# Altium schematic sheet LM_HTR_001.SchDoc: Land Meter Heater Assembly
size Tabloid; DocumentNumber: LM_HTR_001; Revision: A; SheetNumber: 1; SheetTotal: 1
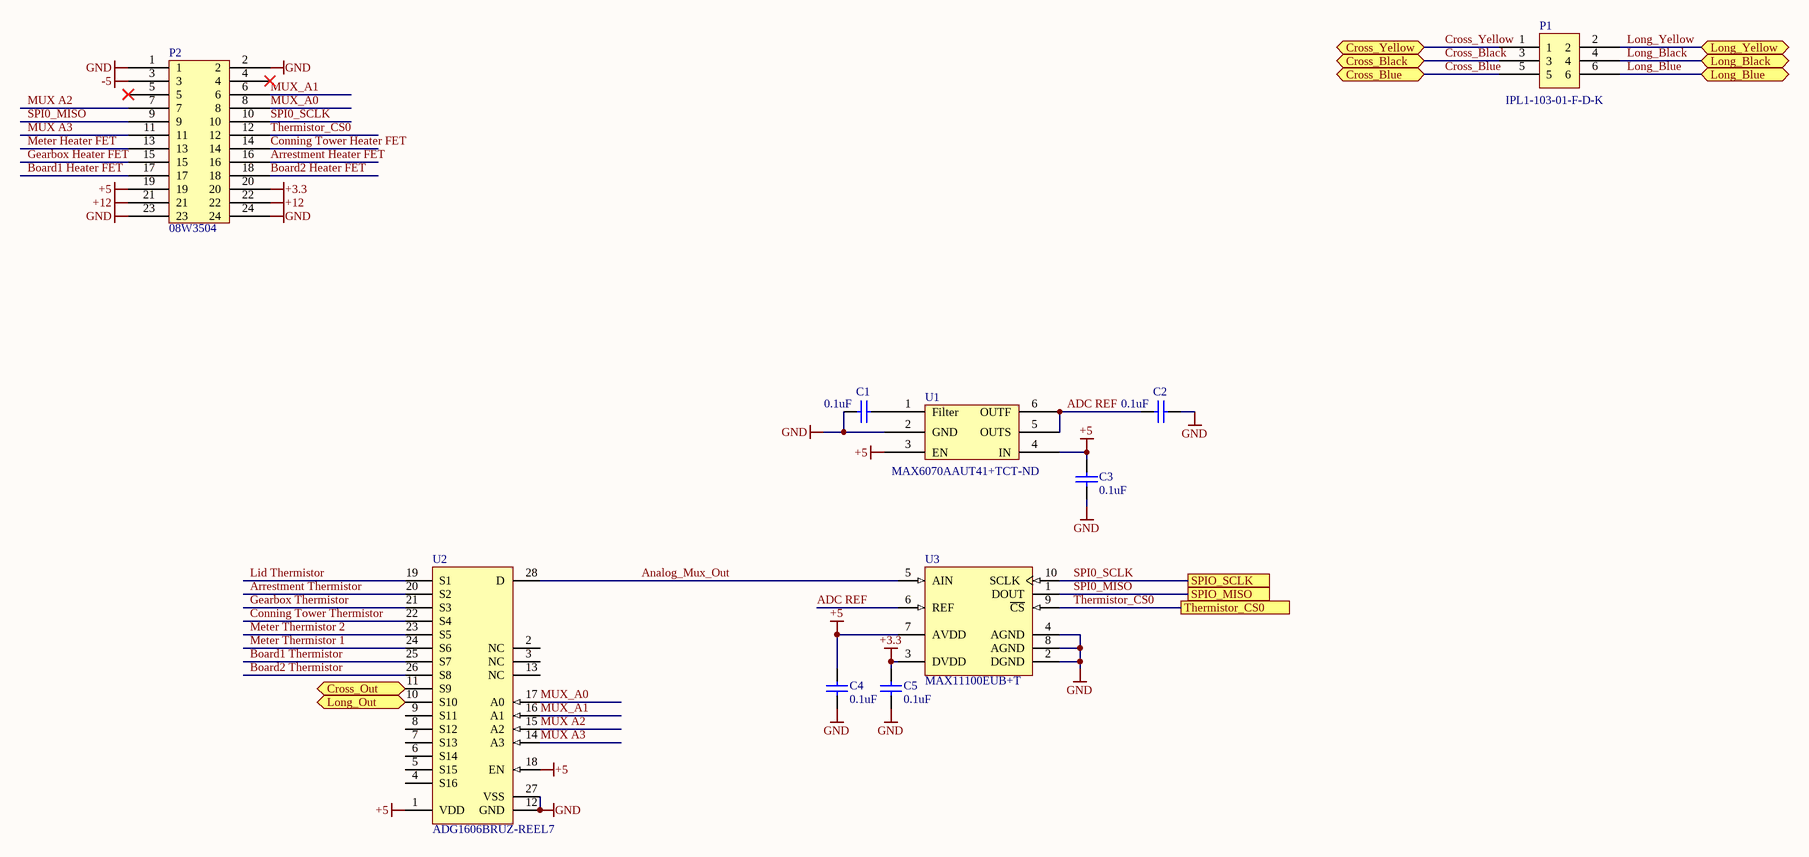
[diagram p0: LM_HTR_001.SchDoc]

## Parts
C1  0.1uF  [CAPC0402(1005)60_L]
C2  0.1uF  [CAPC0402(1005)60_L]
C3  0.1uF  [CAPC0402(1005)60_L]
C4  0.1uF  [CAPC0402(1005)60_L]
C5  0.1uF  [CAPC0402(1005)60_L]
P1  Manufacturer Part Number: IPL1-103-01-F-D-K  [IPL1-103-01-F-D]  (hidden comment: IPL1-103-01-F-D)
P2  Supplier Part Number 1: 08W3504  [IPL1-112-01-F-S-K]  (hidden comment: IPL1-112-01-F-S-K)
U1  Supplier Part Number 1: MAX6070AAUT41+TCT-ND  [SOT95P280X445-6N]  (hidden comment: MAX6070AAUT41+T)
U2  ADG1606BRUZ-REEL7  [ADI-RU-28_M]
U3  MAX11100EUB+T  [U10+2_L]

## Ports
Cross_Black, Cross_Blue, Cross_Out, Cross_Yellow, Long_Black, Long_Blue, Long_Out, Long_Yellow, SPIO_MISO, SPIO_SCLK, Thermistor_CS0

## Nets
+3.3: C5.1 P2.20 U3.3(DVDD)
+5: C3.1 C4.1 P2.19 U1.3(EN) U1.4(IN) U2.1(VDD) U2.18(EN) U3.7(AVDD)
+12: P2.21 P2.22
-5: P2.3
GND: C1.2 C2.1 C3.2 C4.2 C5.2 P2.1 P2.2 P2.23 P2.24 U1.2(GND) U2.12(GND) U2.27(VSS) U3.2(DGND) U3.4(AGND) U3.8(AGND)
ADC REF: C2.2 U1.5(OUTS) U1.6(OUTF) U3.6(REF)
Analog_Mux_Out: U2.28(D) U3.5(AIN)
Arrestment Heater FET: P2.16
Arrestment Thermistor: U2.20(S2)
Board1 Heater FET: P2.17
Board1 Thermistor: U2.25(S7)
Board2 Heater FET: P2.18
Board2 Thermistor: U2.26(S8)
Conning Tower Heater FET: P2.14
Conning Tower Thermistor: U2.22(S4)
Cross_Black: P1.3 ; port Cross_Black
Cross_Blue: P1.5 ; port Cross_Blue
Cross_Out: U2.11(S9) ; port Cross_Out
Cross_Yellow: P1.1 ; port Cross_Yellow
Gearbox Heater FET: P2.15
Gearbox Thermistor: U2.21(S3)
Lid Thermistor: U2.19(S1)
Long_Black: P1.4 ; port Long_Black
Long_Blue: P1.6 ; port Long_Blue
Long_Out: U2.10(S10) ; port Long_Out
Long_Yellow: P1.2 ; port Long_Yellow
Meter Heater FET: P2.13
Meter Thermistor 1: U2.24(S6)
Meter Thermistor 2: U2.23(S5)
MUX A2: P2.7 U2.15(A2)
MUX A3: P2.11 U2.14(A3)
MUX_A0: P2.8 U2.17(A0)
MUX_A1: P2.6 U2.16(A1)
SPI0_MISO: P2.9 U3.1(DOUT) ; port SPIO_MISO
SPI0_SCLK: P2.10 U3.10(SCLK) ; port SPIO_SCLK
Thermistor_CS0: P2.12 U3.9(~{CS}) ; port Thermistor_CS0
NetC1_1: C1.1 U1.1(Filter)

Not connected (* = marked no-connect by the designer): P2 4* 5*; U2 2(NC) 3(NC) 4(S16) 5(S15) 6(S14) 7(S13) 8(S12) 9(S11) 13(NC)

## Notes on the sheet
- Title
- Size:
- Date:
- Tabloid
- Number:
- Time:
- Revision:
- Sheet
- of
- ZLS Corporation
- 7801 North Lamar Blvd.
- Suite E-184
- Austin, Texas 78752  USA
- (512) 453-0288
- File:

## Library data of the parts
C1-C5 = CMP-1034-00252-1: CAP CER 0.1UF 10V X7R 0402; Manufacturer: Murata Electronics North America; Manufacturer Part Number: GRM155R71A104KA01D; Tolerance: ±10%; Supplier 1: Digi-Key; Supplier Part Number 1: 490-6321-1-ND; RoHS: RoHS Compliant; Category: Capacitors; Stock 1: 2920395; Pricing 1: 1=0.1, 10=0.014, 100=0.0063, 500=0.00446, 1000=0.00351, 2500=0.00319, 5000=0.00293 (USD); Packaging: Cut Tape (CT); Part Status: Active; Voltage - Rated: 10V; Temperature Coefficient: X7R; Operating Temperature: -55°C ~ 125°C; Features: -; Ratings: -; Applications: General Purpose; Mounting Type: Surface Mount, MLCC; Package / Case: 0402 (1005 Metric); Size / Dimension: 0.039" L x 0.020" W (1.00mm x 0.50mm); Height - Seated (Max): -; Thickness (Max): 0.022" (0.55mm); Lead Spacing: -; ComponentLink1URL: http://www.murata.com/~/media/webrenewal/support/library/catalog/products/capacitor/mlcc/c02e.ashx?la=en-us; ComponentLink1Description: http://www.murata.com/~/media/webrenewal/support/library/catalog/products/capacitor/mlcc/c02e.ashx?la=en-us
P1 = IPL1-103-01-F-D: Manufacturer: SAMTEC; Supplier 1: Newark; Supplier Part Number 1: 51P2678; Stock 1: 0; Pricing 1: 1=1.8, 5000=1.56, 10000=1.46 (USD); ComponentLink1URL: https://webassistants.partcommunity.com/23d-libs/samtec/search/resolve.html?EMAIL=mysamtec@samtec.com&PN=HTSW-114-05-F-D; ComponentLink1Description: https://webassistants.partcommunity.com/23d-libs/samtec/search/resolve.html?EMAIL=mysamtec@samtec.com&PN=HTSW-114-05-F-D
P2 = IPL1-112-01-F-S-K: IPL1-112-01-F-D-K; Supplier 1: Newark
U1 = MAX6070AAUT41+T: IC VREF SERIES 4.096V SOT23; Manufacturer: Maxim Integrated; Output Type: Fixed; Tolerance: ±0.04%; Temperature Coefficient: 6ppm/°C; Noise - 0.1Hz to 10Hz: 9.6µVp-p; Noise - 10Hz to 10kHz: 9µVrms; Voltage - Input: 4.3 V ~ 5.5 V; Current - Supply: 350µA; Supplier 1: Digi-Key; Manufacturer Part Number: MAX6070AAUT41+T; RoHS: RoHS Compliant; Category: Integrated Circuits (ICs); Stock 1: 2623; Pricing 1: 1=3.41, 10=3.213, 25=2.5704, 50=2.4418, 100=2.2491, 250=2.13344, 500=2.05634 (USD); Packaging: Cut Tape (CT); Part Status: Active; Reference Type: Series; Voltage - Output (Min/Fixed): 4.096V; Operating Temperature: -40°C ~ 125°C (TA); Mounting Type: Surface Mount; Package / Case: SOT-23-6; Supplier Device Package: SOT-23-6; ComponentLink1URL: https://datasheets.maximintegrated.com/en/ds/MAX6070-MAX6071.pdf; ComponentLink1Description: https://datasheets.maximintegrated.com/en/ds/MAX6070-MAX6071.pdf
U2 = CMP-0793-00166-1: 4.5 Ohm Ron, 16-Channel, +/-5 V,+12 V,+5 V and +3.3 V Multiplexer, 28-pin SOP (RU-28), Reel; Manufacturer: Analog Devices; Ron (ohms): 4; t transition (s): 143n; Bandwidth (Hz): 21M, 22M, 19M, 17M; Max Analog Signal Range: Vss to Vdd; ComponentLink1URL: http://www.analog.com/en/index.html; PartNumber: ADG1606BRUZ-REEL7; ComponentLink3URL: http://www.analog.com/static/imported-files/packages/249854663RU_28.pdf; ComponentLink2URL: http://www.analog.com/static/imported-files/data_sheets/ADG1606_1607.pdf; ComponentLink2Description: Datasheet; Mounting Technology: Surface Mount; PackageDescription: 28-Pin Thin Shrink Small Outline Package, Body 9.7 x 4.4 mm, Pitch 0.65 mm; PackageReference: RU-28; ComponentLink3Description: Package Specification; Packing: Reel; Code_JEDEC: MO-153-AE; DatasheetVersion: Rev. 0; ComponentLink1Description: Manufacturer URL; PackageVersion: Mar-05
U3 = CMP-0249-00017-1: 16-Bit, +5V, 200ksps ADC with 10uA Shutdown, 10-Pin uMAX, -40°C to +85°C, Pb-Free, Tape and Reel; DatasheetVersion: Rev 1, Jan-2012; ComponentLink3URL: http://pdfserv.maxim-ic.com/package_dwgs/21-0061.PDF; PackageReference: U10+2; ComponentLink2URL: http://datasheets.maxim-ic.com/en/ds/MAX11100.pdf; PackageVersion: revL, 2008; ComponentLink1Description: Manufacturer URL; Code_JEDEC: MO-187-BA; ComponentLink1URL: http://www.maxim-ic.com; ComponentLink3Description: Package Specification; PackageDescription: 10-Pin Micro-MAX Thin Shrink Small Outline (uSOP), 3 x 3 x 0.85 mm Body, 0.5 mm Pitch, Pb-Free; ComponentLink2Description: Datasheet